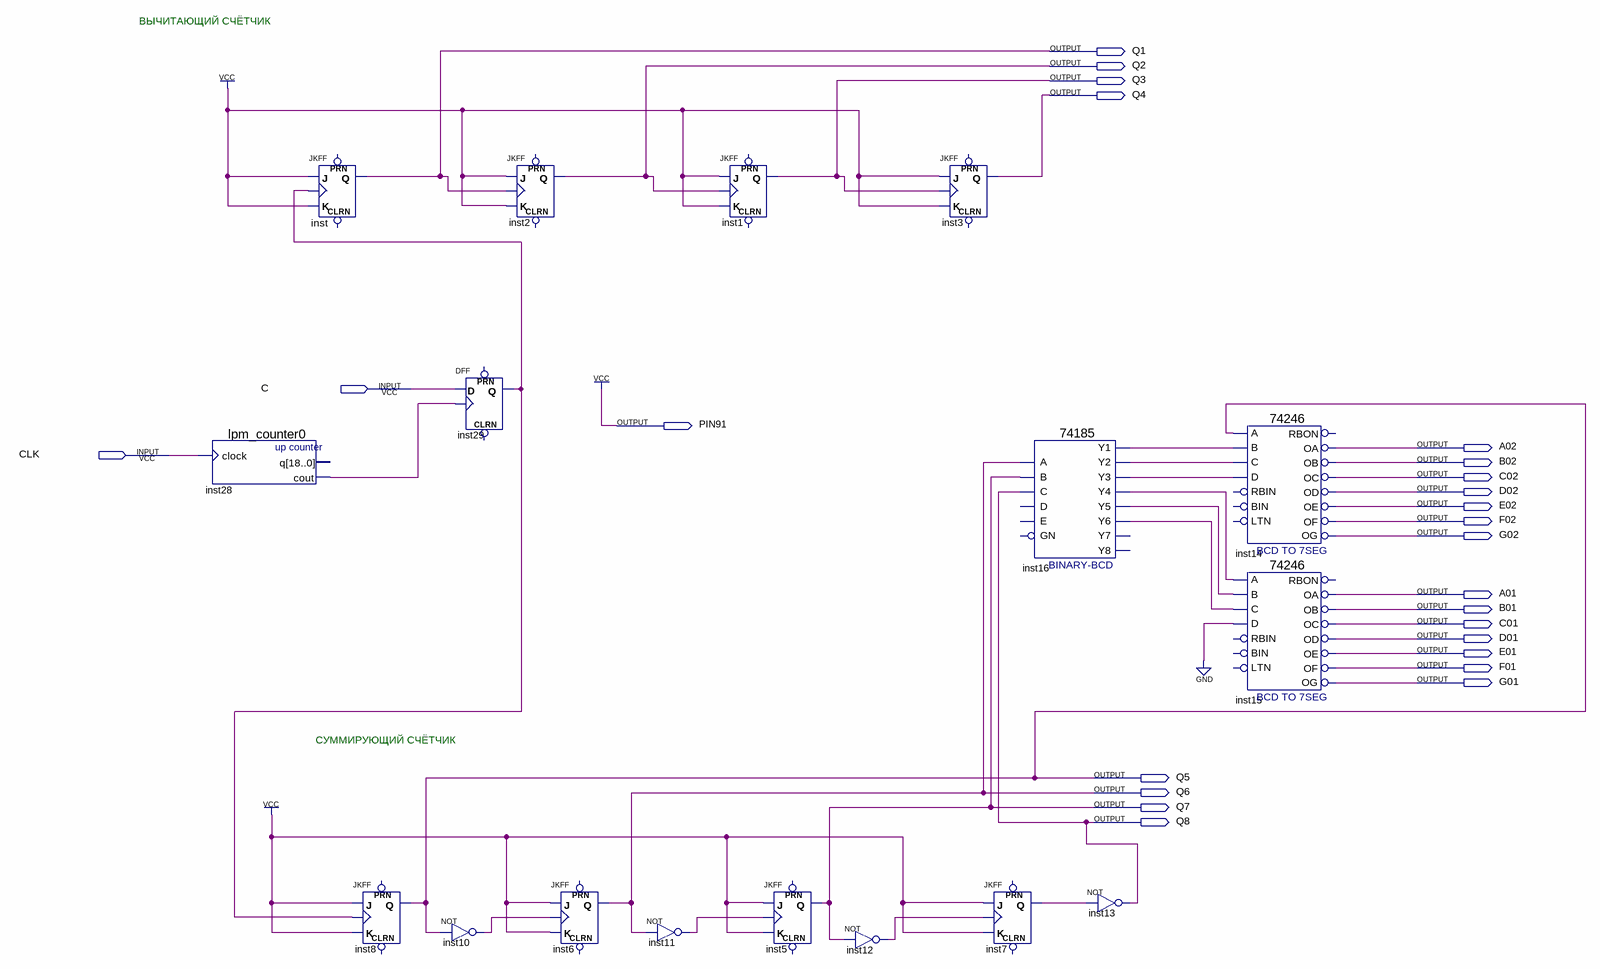
[diagram p0: schematic sheet]
// Quartus schematic Counters.bdf as structural Verilog: 17 symbols, 25 pins
module Counters (
  input  C,
  input  CLK,
  output Q1,
  output Q2,
  output Q3,
  output Q4,
  output PIN91,
  output A02,
  output B02,
  output C02,
  output D02,
  output E02,
  output F02,
  output G02,
  output A01,
  output B01,
  output C01,
  output D01,
  output E01,
  output F01,
  output G01,
  output Q5,
  output Q6,
  output Q7,
  output Q8
);

  wire inst7_q, inst10_out, inst11_out, inst12_out, inst16_y1, inst16_y2, inst16_y3, inst16_y4, inst16_y5,
       inst16_y6, inst28_cout, inst29_q;

  lpm_counter0 inst28 (.clock(CLK), .cout(inst28_cout));  // open: q
  JKFF inst (.K(1'b1), .J(1'b1), .CLK(inst29_q), .Q(Q1));  // open: PRN, CLRN
  JKFF inst8 (.K(1'b1), .J(1'b1), .CLK(inst29_q), .Q(Q5));  // open: PRN, CLRN
  DFF inst29 (.CLK(inst28_cout), .D(C), .Q(inst29_q));  // open: CLRN, PRN
  not inst10 (inst10_out, Q5);
  JKFF inst2 (.K(1'b1), .J(1'b1), .CLK(Q1), .Q(Q2));  // open: PRN, CLRN
  JKFF inst6 (.K(1'b1), .J(1'b1), .CLK(inst10_out), .Q(Q6));  // open: PRN, CLRN
  not inst11 (inst11_out, Q6);
  JKFF inst1 (.K(1'b1), .J(1'b1), .CLK(Q2), .Q(Q3));  // open: PRN, CLRN
  JKFF inst5 (.K(1'b1), .J(1'b1), .CLK(inst11_out), .Q(Q7));  // open: PRN, CLRN
  not inst12 (inst12_out, Q7);
  JKFF inst3 (.K(1'b1), .J(1'b1), .CLK(Q3), .Q(Q4));  // open: PRN, CLRN
  JKFF inst7 (.K(1'b1), .J(1'b1), .CLK(inst12_out), .Q(inst7_q));  // open: PRN, CLRN
  \74185  inst16 (
    .A(Q6), .B(Q7), .C(Q8), .Y1(inst16_y1), .Y3(inst16_y3), .Y2(inst16_y2), .Y5(inst16_y5), .Y4(inst16_y4),
    .Y6(inst16_y6));  // open: D, E, GN, Y8, Y7
  not inst13 (Q8, inst7_q);
  \74246  inst14 (
    .B(inst16_y1), .A(Q5), .D(inst16_y3), .C(inst16_y2), .OD(D02), .OC(C02), .OB(B02), .OE(E02), .OF(F02),
    .OA(A02), .OG(G02));  // open: RBIN, LTN, BIN, RBON
  \74246  inst15 (
    .B(inst16_y5), .A(inst16_y4), .D(1'b0), .C(inst16_y6), .OD(D01), .OC(C01), .OB(B01), .OE(E01), .OF(F01),
    .OA(A01), .OG(G01));  // open: RBIN, LTN, BIN, RBON

  assign PIN91 = 1'b1;

  // Notes on the sheet:
  //   ВЫЧИТАЮЩИЙ СЧЁТЧИК
  //   СУММИРУЮЩИЙ СЧЁТЧИК
endmodule
